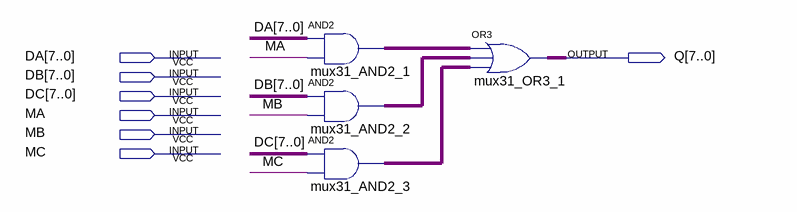
[diagram p0: schematic sheet]
// Quartus schematic mux31.bdf as structural Verilog: 4 symbols, 7 pins
module mux31 (
  input  [7:0] DA,
  input  [7:0] DB,
  input  [7:0] DC,
  input  MA,
  input  MB,
  input  MC,
  output [7:0] Q
);

  wire [7:0] mux31_AND2_1_out, mux31_AND2_2_out, mux31_AND2_3_out;

  assign mux31_AND2_1_out = DA & {8{MA}};  // AND2 mux31_AND2_1, 8 bits wide
  assign mux31_AND2_2_out = DB & {8{MB}};  // AND2 mux31_AND2_2, 8 bits wide
  assign mux31_AND2_3_out = DC & {8{MC}};  // AND2 mux31_AND2_3, 8 bits wide
  assign Q = mux31_AND2_1_out | mux31_AND2_2_out | mux31_AND2_3_out;  // OR3 mux31_OR3_1, 8 bits wide
endmodule
